# EAGLE design Gimbal_test (EAGLE 7.1.0)
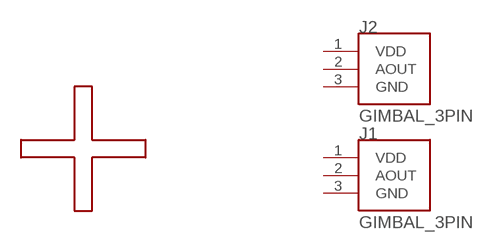
[diagram p0: schematic, sheet 1]

## Parts
J1  GIMBAL_3PIN  [JST-3-PTH]
J2  GIMBAL_3PIN  [JST-3-PTH]
U$1  GIMBAL_MOUNT  [GIMBAL_FOOTPRINT]
Unconnected: J1.2(AOUT) J2.2(AOUT)

## Power pins joined to a net without a drawn wire
GND: J1.3(GND) J2.3(GND)
VDD: J1.1(VDD) J2.1(VDD)

## Library data of the parts
J1 J2 = Controller:GIMBAL_3PIN: This is the surface mount connector for the 9XR Replacement Gimbal. It uses a 3 Pin, 2 mm Pitch, JST connector (https://www.sparkfun.com/products/9750) You can see the analog transmitter here: http://www.hobbyking.com/hobbyking/store/__39505__Transmitter_Gimbal_Set_Left_Turnigy_9XR_Transmitter_Mode_1.html The black wire is VDD, the White wire is Ground, the Red wire is Analog Out Author: Dustin Richmond Created: 10/25/2014
U$1 = Controller:GIMBAL_MOUNT

## Board
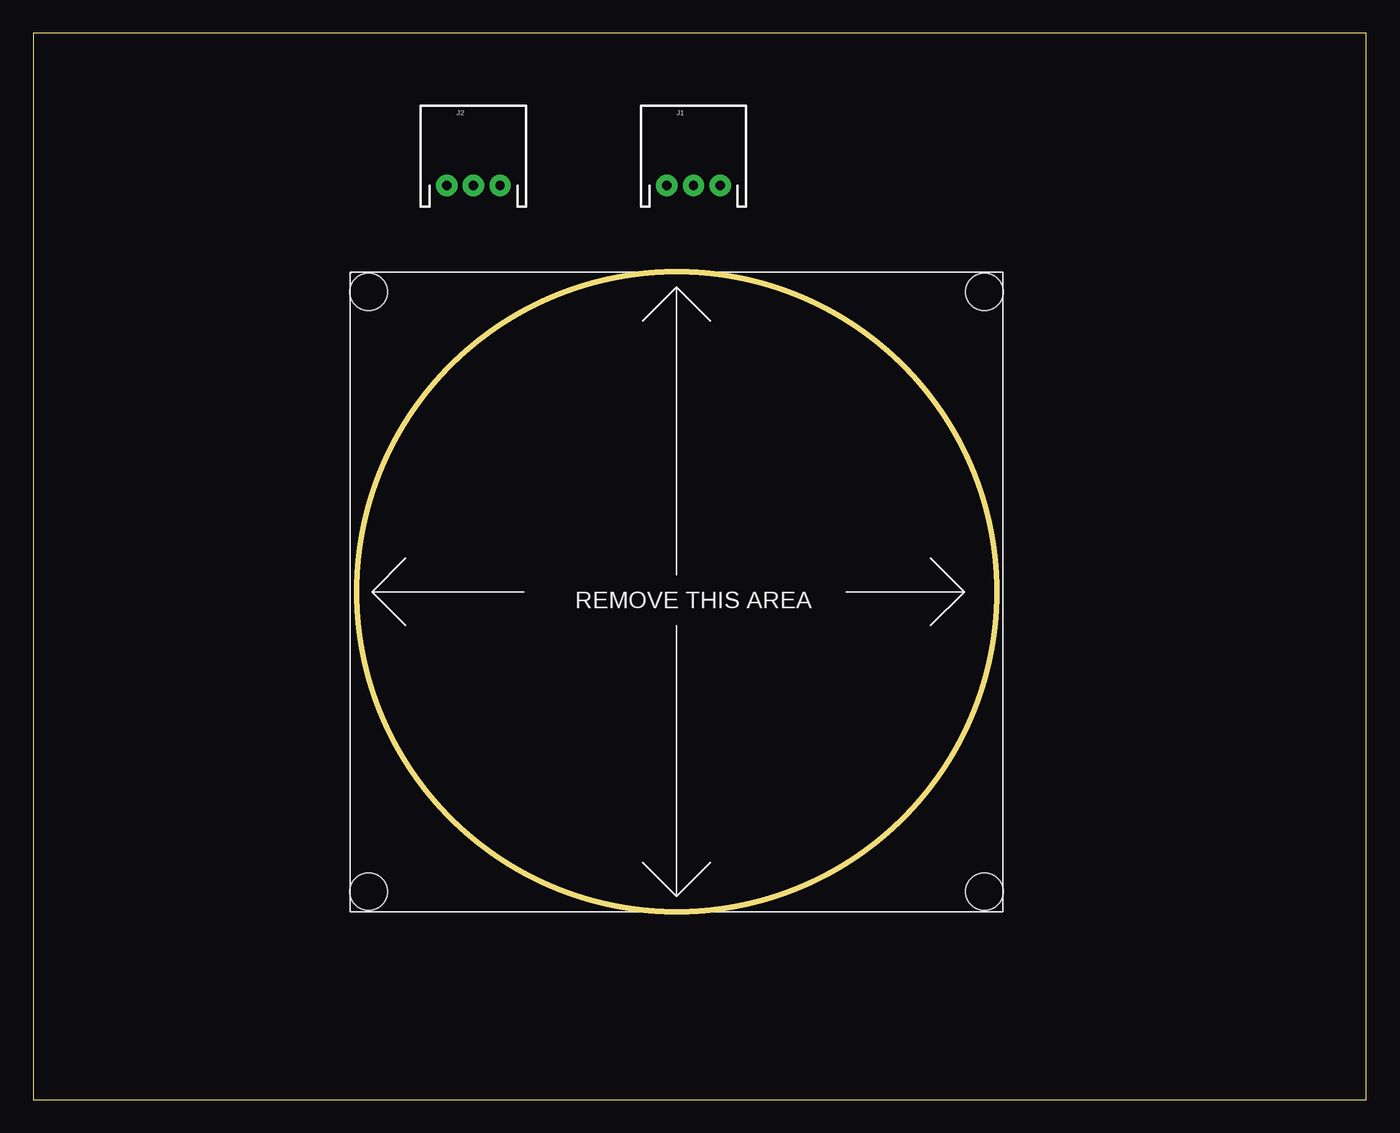
[diagram p1: board, top side]
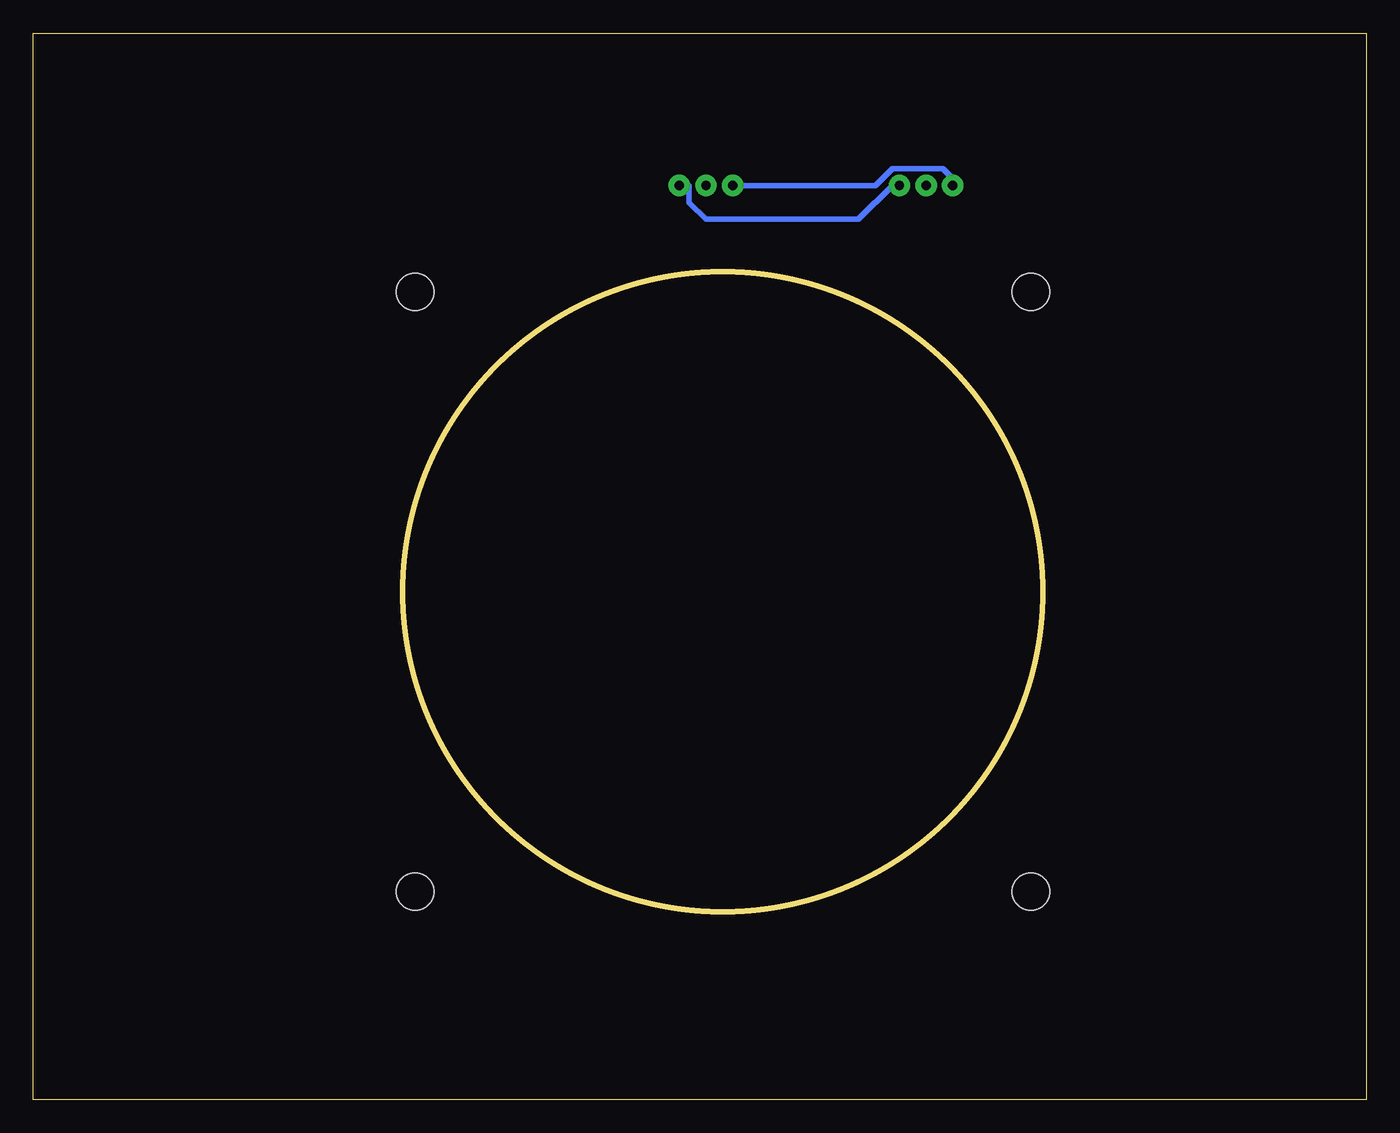
[diagram p2: board, bottom side, seen from below]

Size 100 x 80 mm. Coordinates in mm from the lower left corner, seen from the top.
Outline: 0,0 100,0 100,80 0,80 0,0
Copper layers (1*16): Top 0.035mm / dielectric 1.5mm / Bottom 0.035mm
Design rules "default": minimum track width 10mil, minimum drill 24mil, track to track 8mil, track to pad 8mil, pad to pad 8mil, via to via 8mil, smd to smd 8mil, copper to edge 40mil, drill to drill 8mil, minimum pad ring 10mil, minimum via ring 8mil, stop-mask expansion 4mil, vias tented up to drill 0mil, thermal gap 10mil

### Footprints (pad centres in the part's own frame; a part is rotated, then mirrored left to right if it is on the bottom)
JST-3-PTH = drill 0.7 pad 1.6: 1 -2,0; 2 0,0; 3 2,0
GIMBAL_FOOTPRINT = hole 2.8: -23.1,22.5; -23.1,-22.5; 23.1,-22.5; 23.1,22.5

### Placement (x,y rotation side)
J1  49.53,68.58 0 top
J2  33.02,68.58 0 top
U$1  48.26,38.1 0 top

### Tracks (layer width: path | path; a pad name or v marks a point on that pad's centre or on a via)
GND
  Bottom 0.406: J1.3 50.8,68.58 50.8,67.31 49.53,66.04 38.1,66.04 35.56,68.58 J2.3
VDD
  Bottom 0.406: J1.1 36.83,68.58 35.56,69.85 31.75,69.85 30.48,68.58 J2.1